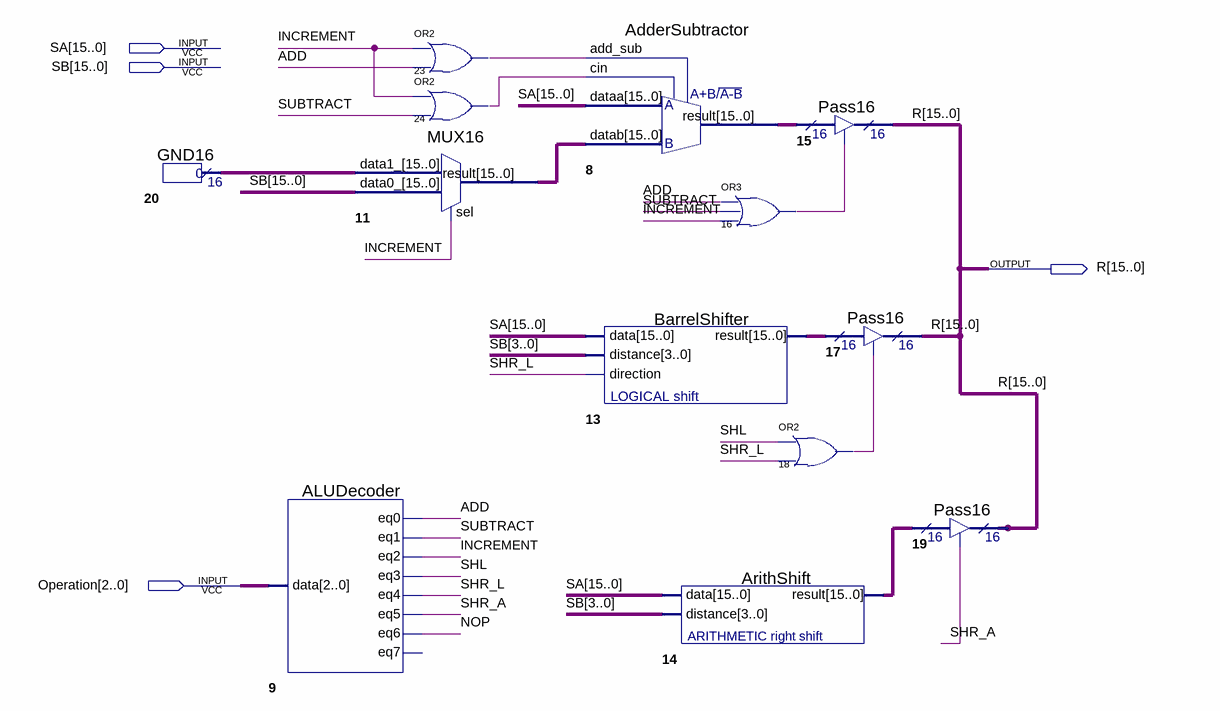
[diagram p0: schematic sheet]
// Quartus schematic alu.bdf as structural Verilog: 13 symbols, 4 pins
module alu (
  input  [15:0] SA,
  input  [15:0] SB,
  input  [2:0] Operation,
  output [15:0] R
);

  wire ADD, INCREMENT, n9_eq7, n16_out, n18_out, n23_out, n24_out, NOP, SHL, SHR_A, SHR_L, SUBTRACT;
  wire [15:0] n8_result, n11_result, n13_result, n14_result, n20_result;

  GND16 u_20 (.result(n20_result));
  ALUDecoder u_9 (
    .data(Operation), .eq0(ADD), .eq1(SUBTRACT), .eq2(INCREMENT), .eq3(SHL), .eq4(SHR_L), .eq5(SHR_A),
    .eq6(NOP), .eq7(n9_eq7));
  MUX16 u_11 (.data1_(n20_result), .data0_(SB), .sel(INCREMENT), .result(n11_result));
  or u_23 (n23_out, INCREMENT, ADD);
  or u_24 (n24_out, INCREMENT, SUBTRACT);
  AdderSubtractor u_8 (.dataa(SA), .datab(n11_result), .add_sub(n23_out), .cin(n24_out), .result(n8_result));
  BarrelShifter u_13 (.data(SA), .distance(SB[3:0]), .direction(SHR_L), .result(n13_result));
  ArithShift u_14 (.data(SA), .distance(SB[3:0]), .result(n14_result));
  or u_16 (n16_out, ADD, SUBTRACT, INCREMENT);
  or u_18 (n18_out, SHL, SHR_L);
  Pass16 u_15 (.enabledt(n16_out), .data(n8_result), .tridata(R));
  Pass16 u_17 (.enabledt(n18_out), .data(n13_result), .tridata(R));
  Pass16 u_19 (.enabledt(SHR_A), .data(n14_result), .tridata(R));
endmodule
